# EAGLE schematic ADB-3020-CDV (EAGLE 8.2.1)
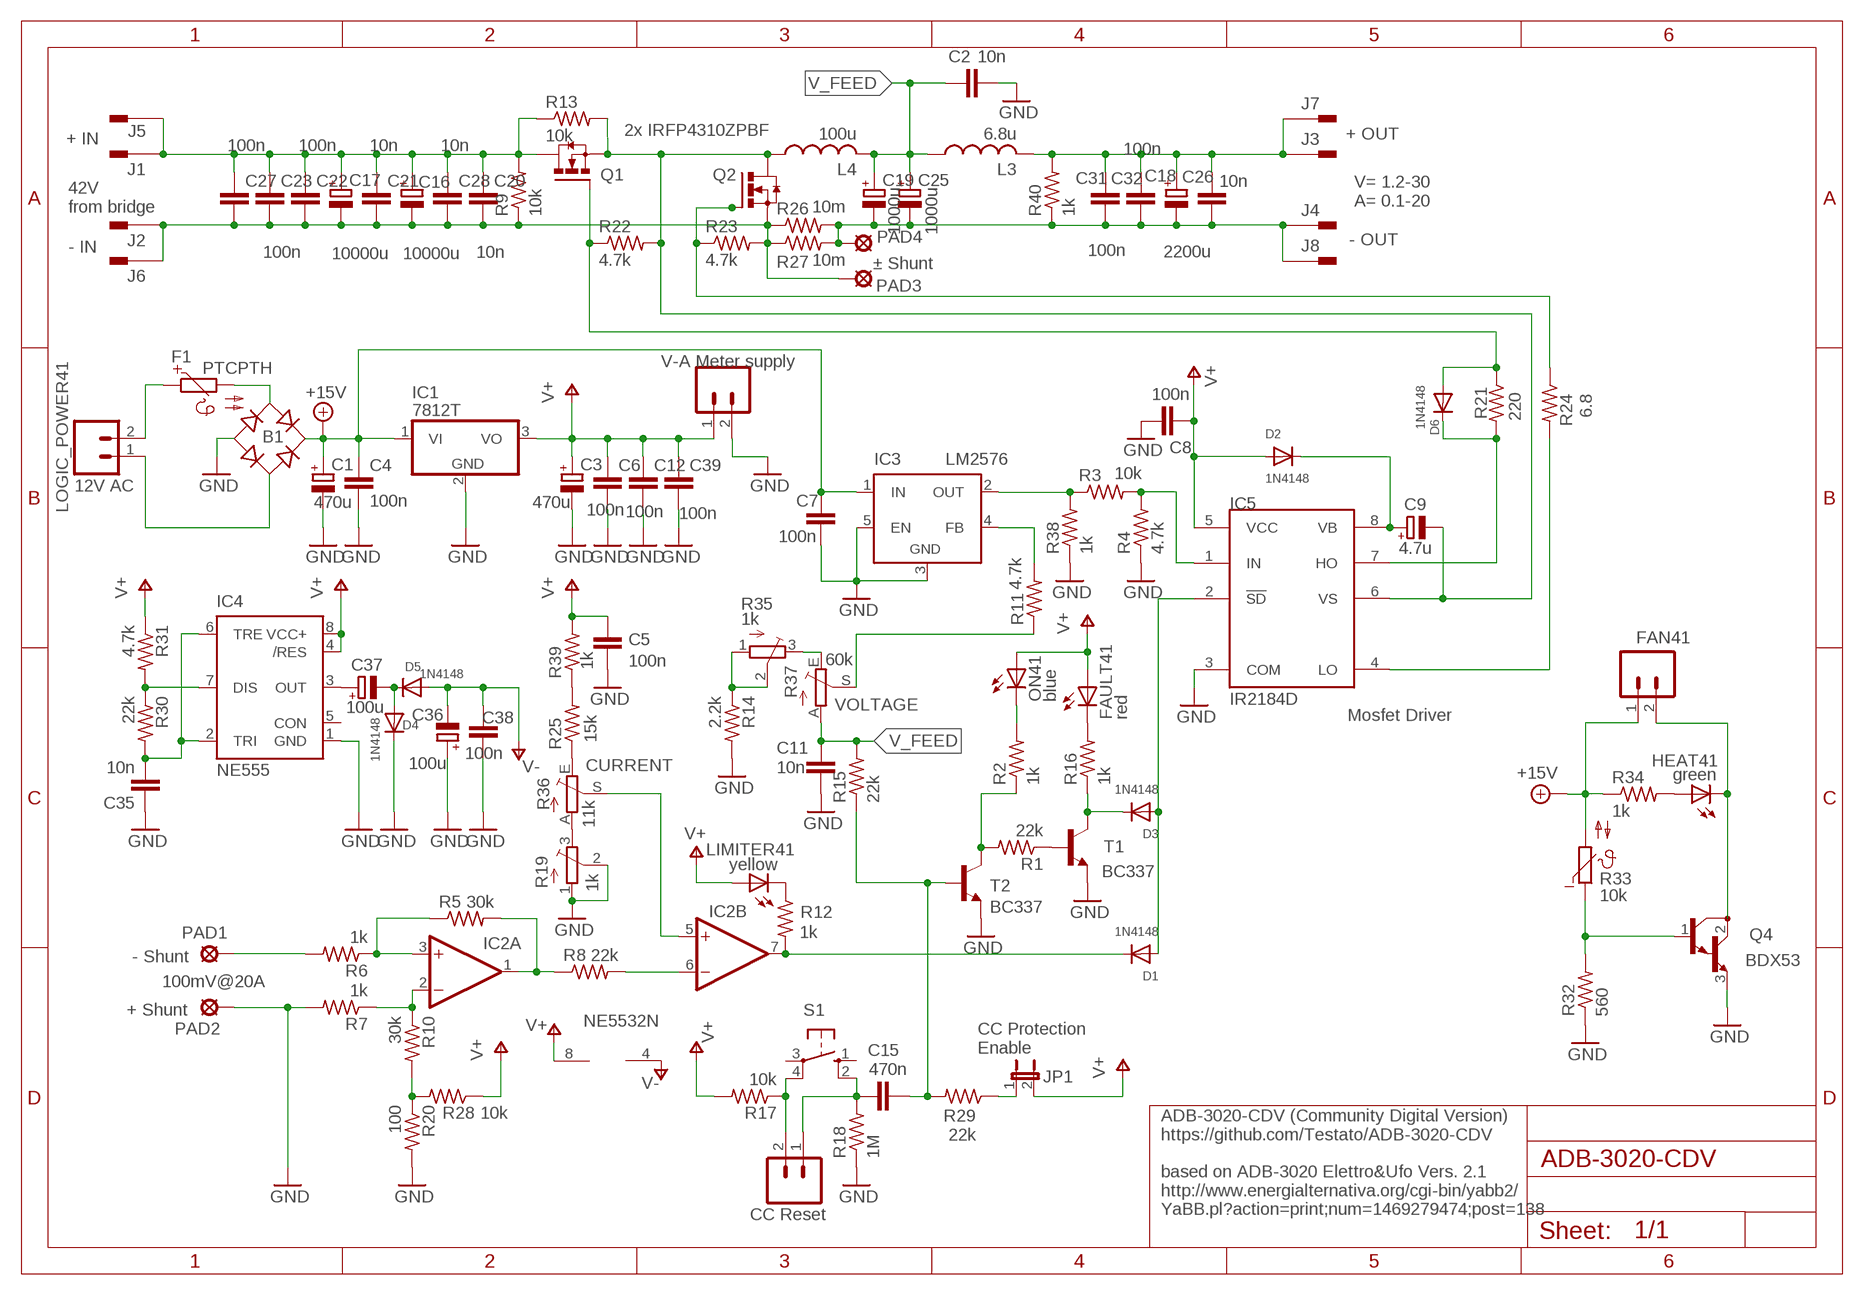
[diagram p0: schematic, sheet 1]

## Parts
B1  RECTIFIER-RB1A  [RB1A]
C1  470u  CPOL-EUE2-5  [E2-5]
C2  10n  C2.5/2  [C2.5-2]
C3  470u  CPOL-EUE2-5  [E2-5]
C4  100n  C2.5/2  [C2.5-2]
C5  100n  C2.5/2  [C2.5-2]
C6  100n  C2.5/2  [C2.5-2]
C7  100n  C2.5/2  [C2.5-2]
C8  100n  C2.5/2  [C2.5-2]
C9  4.7u  CPOL-EUE2-5  [E2-5]
C11  10n  C2.5/2  [C2.5-2]
C12  100n  C2.5/2  [C2.5-2]
C15  470n  C2.5/2  [C2.5-2]
C16  10000u  CPOL-EUE2-5  [E2-5]
C17  10000u  CPOL-EUE2-5  [E2-5]
C18  2200u  CPOL-EUE2-5  [E2-5]
C19  1000u  CPOL-EUE2-5  [E2-5]
C20  10n  C2.5/2  [C2.5-2]
C21  10n  C2.5/2  [C2.5-2]
C22  100n  C2.5/2  [C2.5-2]
C23  100n  C2.5/2  [C2.5-2]
C25  1000u  CPOL-EUE2-5  [E2-5]
C26  10n  C2.5/2  [C2.5-2]
C27  100n  C2.5/2  [C2.5-2]
C28  10n  C2.5/2  [C2.5-2]
C31  100n  C2.5/2  [C2.5-2]
C32  100n  C2.5/2  [C2.5-2]
C35  10n  C2.5/2  [C2.5-2]
C36  100u  CPOL-EUE2-5  [E2-5]
C37  100u  CPOL-EUE2-5  [E2-5]
C38  100n  C2.5/2  [C2.5-2]
C39  100n  C2.5/2  [C2.5-2]
D1  1N4148  DIODEDO-1N4148  [DO-1N4148]
D2  1N4148  DIODEDO-1N4148  [DO-1N4148]
D3  1N4148  DIODEDO-1N4148  [DO-1N4148]
D4  1N4148  DIODEDO-1N4148  [DO-1N4148]
D5  1N4148  DIODEDO-1N4148  [DO-1N4148]
D6  1N4148  DIODEDO-1N4148  [DO-1N4148]
F1  PTCPTH  PTC660  [P660]
FAN41  fan  MA02  [02PA]
FAULT41  red  LED3MM  [LED3MM]
HEAT41  green  LED3MM  [LED3MM]
IC1  7812T  [TO220H]
IC2  NE5532N  [DIL08]
IC3  LM2576  LM2596TH  [TO220-52]
IC4  NE555  [DIL-08]
IC5  IR2184D  [DIL08]
J1  + IN  PIN2F061.040  [F061.040]
J2  - IN  PIN2F061.040  [F061.040]
J3  + OUT  PIN2F061.040  [F061.040]
J4  PIN2F061.040  [F061.040]
J5  + IN  PIN2F061.040  [F061.040]
J6  - IN  PIN2F061.040  [F061.040]
J7  PIN2F061.040  [F061.040]
J8  - OUT  PIN2F061.040  [F061.040]
JP1  jp1  JP1E  [JP1]
L3  6.8u  L  [6000]
L4  100u  L  [6000]
LIMITER41  yellow  LED3MM  [LED3MM]
LOGIC_POWER41  12V AC  MA02  [02PA]
ON41  blue  LED3MM  [LED3MM]
PAD1  LSP13  [LSP13]
PAD2  LSP13  [LSP13]
PAD3  LSP13  [LSP13]
PAD4  LSP13  [LSP13]
Q1  IRFP240-H  [TO247BH]
Q2  IRFP240-H  [TO247BH]
Q4  BDX53  [TO220]
R1  22k  R-US_0204/5  [0204/5]
R2  1k  R-US_0204/5  [0204/5]
R3  10k  R-US_0204/5  [0204/5]
R4  4.7k  R-US_0204/5  [0204/5]
R5  30k  R-US_0204/5  [0204/5]
R6  1k  R-US_0204/5  [0204/5]
R7  1k  R-US_0204/5  [0204/5]
R8  22k  R-US_0204/5  [0204/5]
R9  10k  R-US_0204/5  [0204/5]
R10  30k  R-US_0204/5  [0204/5]
R11  4.7k  R-US_0204/5  [0204/5]
R12  1k  R-US_0204/5  [0204/5]
R13  10k  R-US_0204/5  [0204/5]
R14  2.2k  R-US_0204/5  [0204/5]
R15  22k  R-US_0204/5  [0204/5]
R16  1k  R-US_0204/5  [0204/5]
R17  10k  R-US_0204/5  [0204/5]
R18  1M  R-US_0204/5  [0204/5]
R19  1k  TRIMPOT3386  [TRIM-3386]
R20  100  R-US_0204/5  [0204/5]
R21  220  R-US_0204/5  [0204/5]
R22  4.7k  R-US_0204/5  [0204/5]
R23  4.7k  R-US_0204/5  [0204/5]
R24  6.8  R-US_0204/5  [0204/5]
R25  15k  R-US_0204/5  [0204/5]
R26  10m  R-US_0204/5  [0204/5]
R27  10m  R-US_0204/5  [0204/5]
R28  10k  R-US_0204/5  [0204/5]
R29  22k  R-US_0204/5  [0204/5]
R30  22k  R-US_0204/5  [0204/5]
R31  4.7k  R-US_0204/5  [0204/5]
R32  560  R-US_0204/5  [0204/5]
R33  10k  NTC640  [P640]
R34  1k  R-US_0204/5  [0204/5]
R35  1k  TRIMPOT3386  [TRIM-3386]
R36  11k  TRIM_1234-S64YW  [S64YW]
R37  60k  TRIM_1234-S64YW  [S64YW]
R38  1k  R-US_0204/5  [0204/5]
R39  1k  R-US_0204/5  [0204/5]
R40  1k  R-US_0204/5  [0204/5]
RESET41  CC Reset  MA02  [02PA]
S1  CC Reset  40-XX  [B3F-40XX]
T1  BC337  [TO92]
T2  BC337  [TO92]
V-A_METER_SUPPLY41  V-A Meter supply  MA02  [02PA]

## Nets
+15V: B1.+ C1.+ C4.1 C7.1 FAN41.1 IC1.1(VI) IC3.1(IN) R33.2 R34.1
GND: B1.- C1.- C2.2 C3.- C4.2 C5.1 C6.2 C7.2 C8.2 C11.2 C12.2 C35.1 C36.+ C38.1 C39.2 D4.C IC1.2(GND) IC3.3(GND) IC3.5(EN) IC4.1(GND) IC5.3(COM) PAD2.MP Q4.3(E) R4.1 R7.2 R14.2 R18.1 R19.1(A) R19.2(S) R20.2 R32.1 R38.1 T1.1(E) T2.1(E) V-A_METER_SUPPLY41.2
N$1: B1.AC2 LOGIC_POWER41.1
N$2: B1.AC1 F1.2
N$3: F1.1 LOGIC_POWER41.2
N$4: D6.A Q1.G R21.1 R22.1
N$5: IC5.1(IN) R3.2 R4.2
N$6: IC2.6(B:-IN) R8.2
N$7: IC3.4(FB) R11.2
N$8: IC3.2(OUT) R3.1 R38.2
N$9: JP1.1 R29.1
N$10: C37.+ IC4.3(OUT)
N$12: C37.- D4.A D5.C
N$14: R25.2 R39.1
N$15: FAULT41.K(C) R16.2
N$19: R10.2 R20.1 R28.2
N$20: ON41.K(C) R2.2
N$21: LIMITER41.K(C) R12.1
N$22: R1.1 T1.2(B)
N$23: IC4.7(DIS) R30.1 R31.2
N$24: C35.2 IC4.2(TRI) IC4.6(TRE) R30.2
N$30: R25.1 R36.E
N$31: R19.3(E) R36.A
N$32: IC2.5(B:+IN) R36.S
N$34: IC2.1(A:OUT) R5.2 R8.1
N$35: IC2.3(A:+IN) R5.1 R6.1
N$36: IC2.2(A:-IN) R7.1 R10.1
N$37: PAD1.MP R6.2
N$39: R17.1 RESET41.2 S1.4(P1)
N$42: C15.1 R18.2 RESET41.1 S1.2(S1)
N$44: C15.2 R15.1 R29.2 T2.2(B)
N$45: D1.C IC2.7(B:OUT) R12.2
N$47: R14.1 R35.1(A) R35.2(S)
N$48: R35.3(E) R37.E
N$50: R1.2 R2.1 T2.3(C)
N$51: R11.1 R37.S
N$52: D3.C R16.1 T1.3(C)
N$54: D1.A D3.A IC5.2(!SD)
N$58: C18.- C19.- C25.- C26.2 C31.2 C32.2 J4.A1 J4.A2 J8.A1 J8.A2 PAD4.MP R26.2 R27.2 R40.1
N$60: D6.C IC5.7(HO) R21.2
N$63: C16.+ C17.+ C20.1 C21.1 C22.1 C23.1 C27.1 C28.1 J1.A1 J1.A2 J5.A1 J5.A2 Q1.D R9.2 R13.1
N$65: IC5.4(LO) R24.2
N$66: Q2.G R23.1 R24.1
N$67: HEAT41.A R34.2
N$68: FAN41.2 HEAT41.K(C) Q4.2(C)
N$71: Q4.1(B) R32.2 R33.1
N$74: C16.- C17.- C20.2 C21.2 C22.2 C23.2 C27.2 C28.2 J2.A1 J2.A2 J6.A1 J6.A2 PAD3.MP Q2.S R9.1 R23.2 R26.1 R27.1
N$77: C18.+ C26.1 C31.1 C32.1 J3.A1 J3.A2 J7.A1 J7.A2 L3.2 R40.2
V+: C3.+ C5.2 C6.1 C8.1 C12.1 C39.1 D2.A FAULT41.A IC1.3(VO) IC2.8(P:V+) IC4.4(/RES) IC4.8(VCC+) IC5.5(VCC) JP1.2 LIMITER41.A ON41.A R17.2 R28.1 R31.1 R39.2 V-A_METER_SUPPLY41.1
V-: C36.- C38.2 D5.A IC2.4(P:V-)
V_FEED: C2.1 C11.1 C19.+ C25.+ L3.1 L4.2 R15.2 R37.A
VB: C9.+ D2.C IC5.8(VB)
VS: C9.- IC5.6(VS) L4.1 Q1.S Q2.D R13.2 R22.2
Unconnected: IC4.5(CON) R36.S@1(S) R37.S@1(S) S1.1(S) S1.3(P)

## Notes on the sheet
- 2x IRFP4310ZPBF
- V= 1.2-30
  A= 0.1-20
- 42V
  from bridge
- ± Shunt
- VOLTAGE
- Mosfet Driver
- CURRENT
- - Shunt
- 100mV@20A
- + Shunt
- CC Protection
  Enable
- ADB-3020-CDV (Community Digital Version)
  https://github.com/Testato/ADB-3020-CDV
  
  based on ADB-3020 Elettro&Ufo Vers. 2.1
  http://www.energialternativa.org/cgi-bin/yabb2/
  YaBB.pl?action=print;num=1469279474;post=138

## Library data of the parts
B1 = rectifier:RECTIFIER-: Rectifier
C1 C3 C9 C16-C19 C25 C36 C37 = rcl:CPOL-EU: POLARIZED CAPACITOR, European symbol
C2 C4-C8 C11 C12 C15 C20-C23 C26-C28 C31 C32 C35 C38 C39 = capacitor-wima:C: CAPACITOR naming: grid - package width
D1-D6 = adafruit:DIODE: Diode SMADIODE - SMA Surface Mount Package 20V 1A Schottky Diode Digikey: 641-1014-6-ND DO-1N4148 - Through Hole Small Current Diode SOD-123 20V 1 A (.5mV Vf) Schottky Diode - Digikey: MBRX120TPMSCT-ND SOD-323 10V 570mA (.38mV Vf, 3ns) Schottky Diode - Digikey: ZLLS410CT-ND SOD-523 30V 30mA Schottky Diode (RB751S-40TE61) - Digikey: RB751S-40TE61CT-ND SOT23-R/W - SOT23 Package (R = Solder Paste/Reflow Ovens, W = Hand-Soldering) BAT54Film 40V 300mA - Digikey: 497-7162-1-ND
F1 = ptc-ntc:PTC660: PHILIPS PTC; OC_FARNELL: unknown; OC_NEWARK: unknown
FAN41 LOGIC_POWER41 RESET41 V-A_METER_SUPPLY41 = con-amp-quick:MA02: AMP QUICK CONNECTOR; OC_FARNELL: unknown; OC_NEWARK: unknown
FAULT41 HEAT41 LIMITER41 ON41 = adafruit:LED: LED OSRAM: - CHIPLED LG R971, LG N971, LY N971, LG Q971, LY Q971, LO R971, LY R971 LH N974, LH R974 LS Q976, LO Q976, LY Q976 LO Q996 - Hyper CHIPLED LW Q18S LB Q993, LB Q99A, LB R99A - SideLED LS A670, LO A670, LY A670, LG A670, LP A670 LB A673, LV A673, LT A673, LW A673 LH A674 LY A675 LS A676, LA A676, LO A676, LY A676, LW A676 LS A679, LY A679, LG A679 - Hyper Micro SIDELED® LS Y876, LA Y876, LO Y876, LY Y876 LT Y87S - SmartLED LW L88C, LW L88S LB L89C, LB L89S, LG L890 LS L89K, LO L89K, LY L89K LS L896, LA L896, LO L896, LY L896 - TOPLED LS T670, LO T670, LY T670, LG T670, LP T670 LSG T670, LSP T670, LSY T670, LOP T670, LYG T670 LG T671, LOG T671, LSG T671 LB T673, LV T673, LT T673, LW T673 LH T674 LS T676, LA T676, LO T676, LY T676, LB T676, LH T676, LSB T676, LW T676 LB T67C, LV T67C, LT T67C, LS T67K, LO T67K, LY T67K, LW E67C LS E67B, LA E67B, LO E67B, LY E67B, LB E67C, LV E67C, LT E67C LW T67C LS T679, LY T679, LG T679 LS T770, LO T770, LY T770, LG T770, LP T770 LB T773, LV T773, LT T773, LW T773 LH T774 LS E675, LA E675, LY E675, LS T675 LS T776, LA T776, LO T776, LY T776, LB T776 LHGB T686 LT T68C, LB T68C - Hyper Mini TOPLED® LB M676 - Mini TOPLED Santana® LG M470 LS M47K, LO M47K, LY M47K Source: http://www.osram.convergy.de/
IC1 = adafruit:78*: Positive VOLTAGE REGULATOR Added bigger pads to the TO-92 package
IC2 = linear:NE5532: AUDIO AMPLIFIER
IC3 = linear:LM2596T: STEP-DOWN VOLTAGE REGULATOR
IC4 = st-microelectronics:NE555: General purpose bipolar Timer; MF: Arrow Electronics; MPN: NE555N; OC_FARNELL: 1467742; OC_NEWARK: 89K1486
IC5 = irs:IR2184
J1-J8 = con-faston:PIN2: Flachstecker Typ Tyco/Electronics/AMP TAB, FASTON Printed Circuit Board Tabs Source: http://www.buerklin.com, http://catalog.tycoelectronics.com; OC_FARNELL: unknown; OC_NEWARK: unknown
JP1 = jumper:JP1E: JUMPER
L3 L4 = adafruit:L
PAD1-PAD4 = solpad:LSP13: SOLDER PAD drill 1.3 mm, distributor Buerklin, 12H562
Q1 Q2 = transistor-power:IRFP240: HEXFET Power MosFet Source: http://www.irf.com/
Q4 = transistor:BDX53: NPN BIPOLAR DARLINGTON TRANSISTOR
R1-R18 R20-R32 R34 R38-R40 = adafruit:R-US_: RESISTOR, American symbol
R19 R35 = adafruit:TRIMPOT: SMT trimmer potentiometer part number TC33X http://www.ladyada.net/library/eagle
R33 = ptc-ntc:NTC640: PHILIPS NTC; OC_FARNELL: unknown; OC_NEWARK: unknown
R36 R37 = pot:TRIM_1234-: POTENTIOMETER
S1 = adafruit:40-XX: OMRON SWITCH; MF: OMRON COMPONENTS USA; MPN: B3F-4000; OC_FARNELL: 176434; OC_NEWARK: 36K3105
T1 T2 = transistor:BC337: NPN TRANSISTOR